# EAGLE design mb_01-2 (EAGLE 7.7.0)
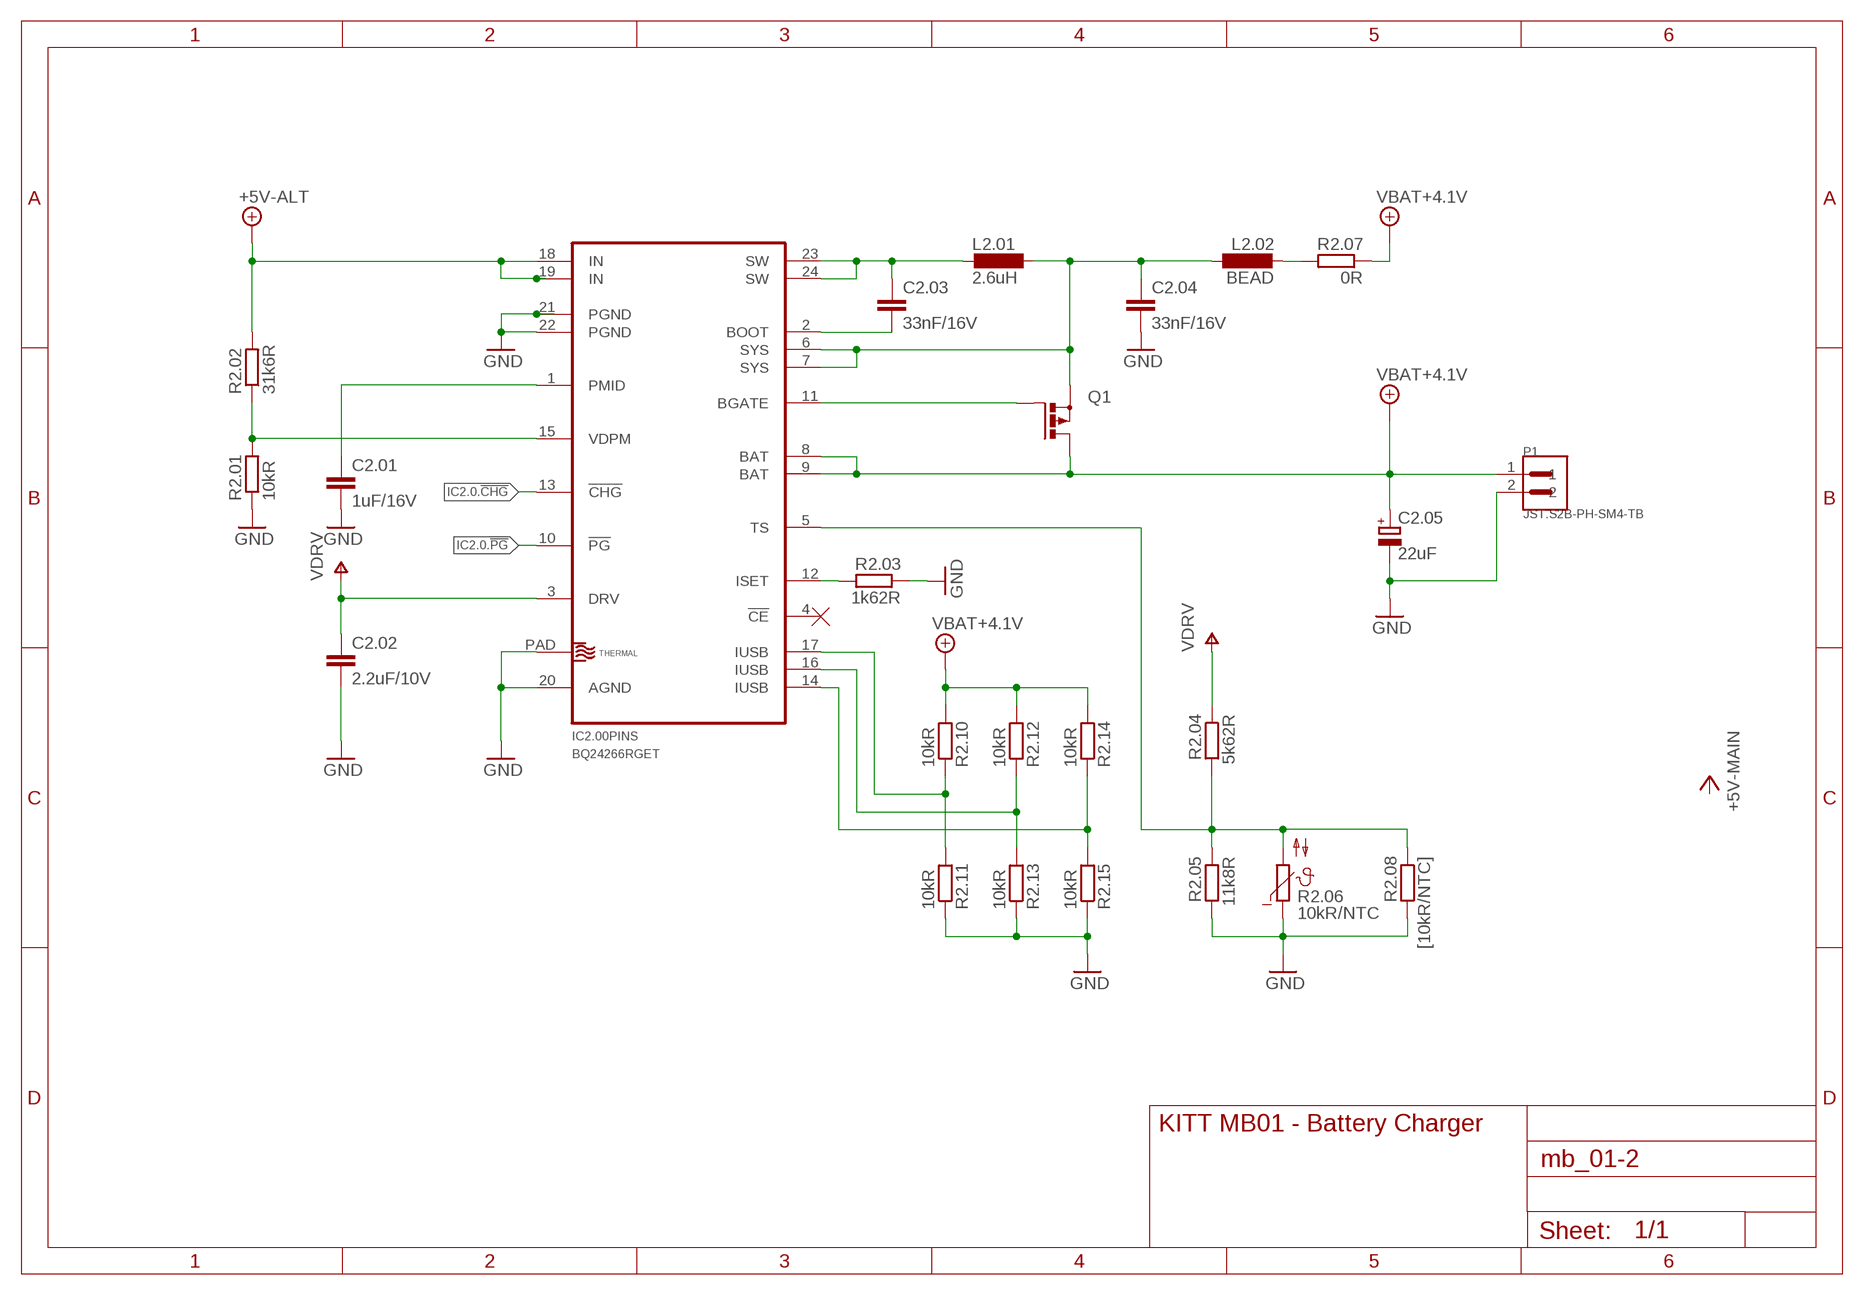
[diagram p0: schematic, sheet 1]

## Parts
C2.01  1uF/16V  C-EUC0805  [C0805]
C2.02  2.2uF/10V  C-EUC0603K  [C0603K]
C2.03  33nF/16V  C-EUC0603  [C0603]
C2.04  33nF/16V  C-EUC0805  [C0805]
C2.05  22uF  CPOL-EUA/3216-18R  [A/3216-18R]
IC2.00  BQ24266RGET  [VQFN-24]
L2.01  2.6uH  L-EUWE-TPC  [POWER-CHOKE_WE-TPC]
L2.02  BEAD  L-EUL2012C  [L2012C]
P1  JST.S2B-PH-SM4-TB  [JST_S2B-PH-SM4-TB(LF)(SN)]
Q1  P-MOSFET-SO8  [SO-08]
R2.01  10kR  R-EU_R0402  [R0402]
R2.02  31k6R  R-EU_R0402  [R0402]
R2.03  1k62R  R-EU_R0402  [R0402]
R2.04  5k62R  R-EU_R0402  [R0402]
R2.05  11k8R  R-EU_R0402  [R0402]
R2.06  10kR/NTC  V642  [P642]
R2.07  0R  R-EU_R0402  [R0402]
R2.08  [10kR/NTC]  R-EU_R0402  [R0402]
R2.10  10kR  R-EU_R0402  [R0402]
R2.11  10kR  R-EU_R0402  [R0402]
R2.12  10kR  R-EU_R0402  [R0402]
R2.13  10kR  R-EU_R0402  [R0402]
R2.14  10kR  R-EU_R0402  [R0402]
R2.15  10kR  R-EU_R0402  [R0402]

## Nets
+4.1V: C2.05.+ IC2.00.8(PINS:BAT) IC2.00.9(PINS:BAT) P1.1 Q1.5(D) Q1.6(D) Q1.7(D) Q1.8(D) R2.07.1 R2.10.2 R2.12.2 R2.14.2 ; supply symbol labelled VBAT+4.1V
+5V: IC2.00.18(PINS:IN) IC2.00.19(PINS:IN) R2.02.2 ; supply symbol labelled +5V-ALT
GND: C2.01.2 C2.02.2 C2.04.2 C2.05.- IC2.00.20(PINS:AGND) IC2.00.21(PINS:PGND) IC2.00.22(PINS:PGND) IC2.00.PAD(PAD:THERMAL) P1.2 R2.01.1 R2.03.1 R2.05.2 R2.06.1 R2.08.2 R2.11.1 R2.13.1 R2.15.1
IC2.0.!CHG: IC2.00.13(PINS:!CHG)
IC2.0.!PG: IC2.00.10(PINS:!PG)
N$8: C2.01.1 IC2.00.1(PINS:PMID)
N$11: IC2.00.15(PINS:VDPM) R2.01.2 R2.02.1
N$12: C2.03.1 IC2.00.23(PINS:SW) IC2.00.24(PINS:SW) L2.01.2
N$13: C2.03.2 IC2.00.2(PINS:BOOT)
N$14: IC2.00.11(PINS:BGATE) Q1.4(G)
N$15: IC2.00.5(PINS:TS) R2.04.2 R2.05.1 R2.06.2 R2.08.1
N$16: L2.02.2 R2.07.2
N$18: C2.04.1 IC2.00.6(PINS:SYS) IC2.00.7(PINS:SYS) L2.01.1 L2.02.1 Q1.1(S) Q1.2(S) Q1.3(S)
N$19: IC2.00.12(PINS:ISET) R2.03.2
N$20: IC2.00.17(PINS:IUSB) R2.10.1 R2.11.2
N$21: IC2.00.16(PINS:IUSB) R2.12.1 R2.13.2
N$22: IC2.00.14(PINS:IUSB) R2.14.1 R2.15.2
V+: C2.02.1 IC2.00.3(PINS:DRV) R2.04.1 ; supply symbol labelled VDRV
Unconnected: IC2.00.4(PINS:!CE)

## Notes on the sheet
- KITT MB01 - Battery Charger

## Library data of the parts
C2.01-C2.04 = rcl:C-EU: CAPACITOR, European symbol
C2.05 = rcl:CPOL-EU: POLARIZED CAPACITOR, European symbol
IC2.00 = kitt.ic:BQ24266RGET
L2.01 L2.02 = rcl:L-EU: INDUCTOR, European symbol
P1 = kitt.con:JST.S2B-PH-SM4-TB: CONN HEADER PH SIDE 2POS 2MM SMD; AVAILABILITY: Good; DESCRIPTION: PH Series 2 Position 2 mm Pitch Surface Mount Side Entry Shrouded Header; MF: JST; MP: S2B-PH-SM4-TB(LF)(SN); PACKAGE: FakePackage u; PRICE: 0.32 USD
Q1 = transistor-power:P-MOSFET-SO8: P-Channel MOSFET Example: FDS4435A; P-Channel Logic Level PowerTrench® MOSFET FDS4465; P-Channel 1.8V Specified PowerTrench® MOSFET Source: www.fairchildsemi.com
R2.01-R2.05 R2.07 R2.08 R2.10-R2.15 = rcl:R-EU_: RESISTOR, European symbol
R2.06 = ptc-ntc:V642: VALVO NTC; OC_FARNELL: unknown; OC_NEWARK: unknown

## Board
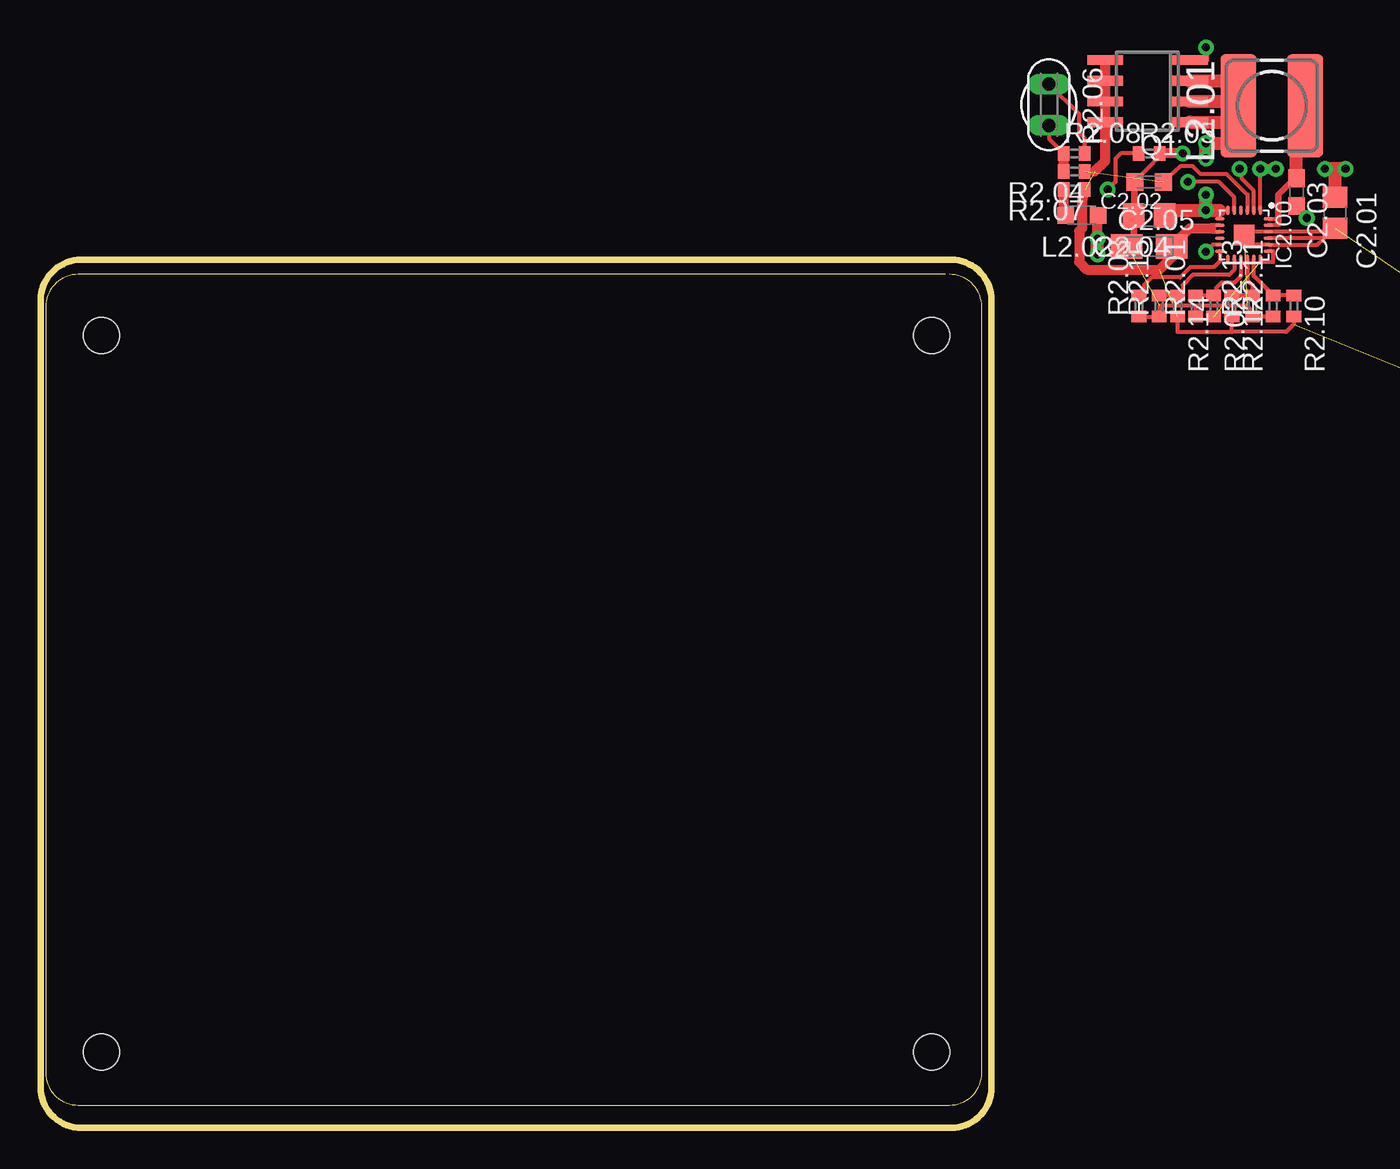
[diagram p1: board, top side]
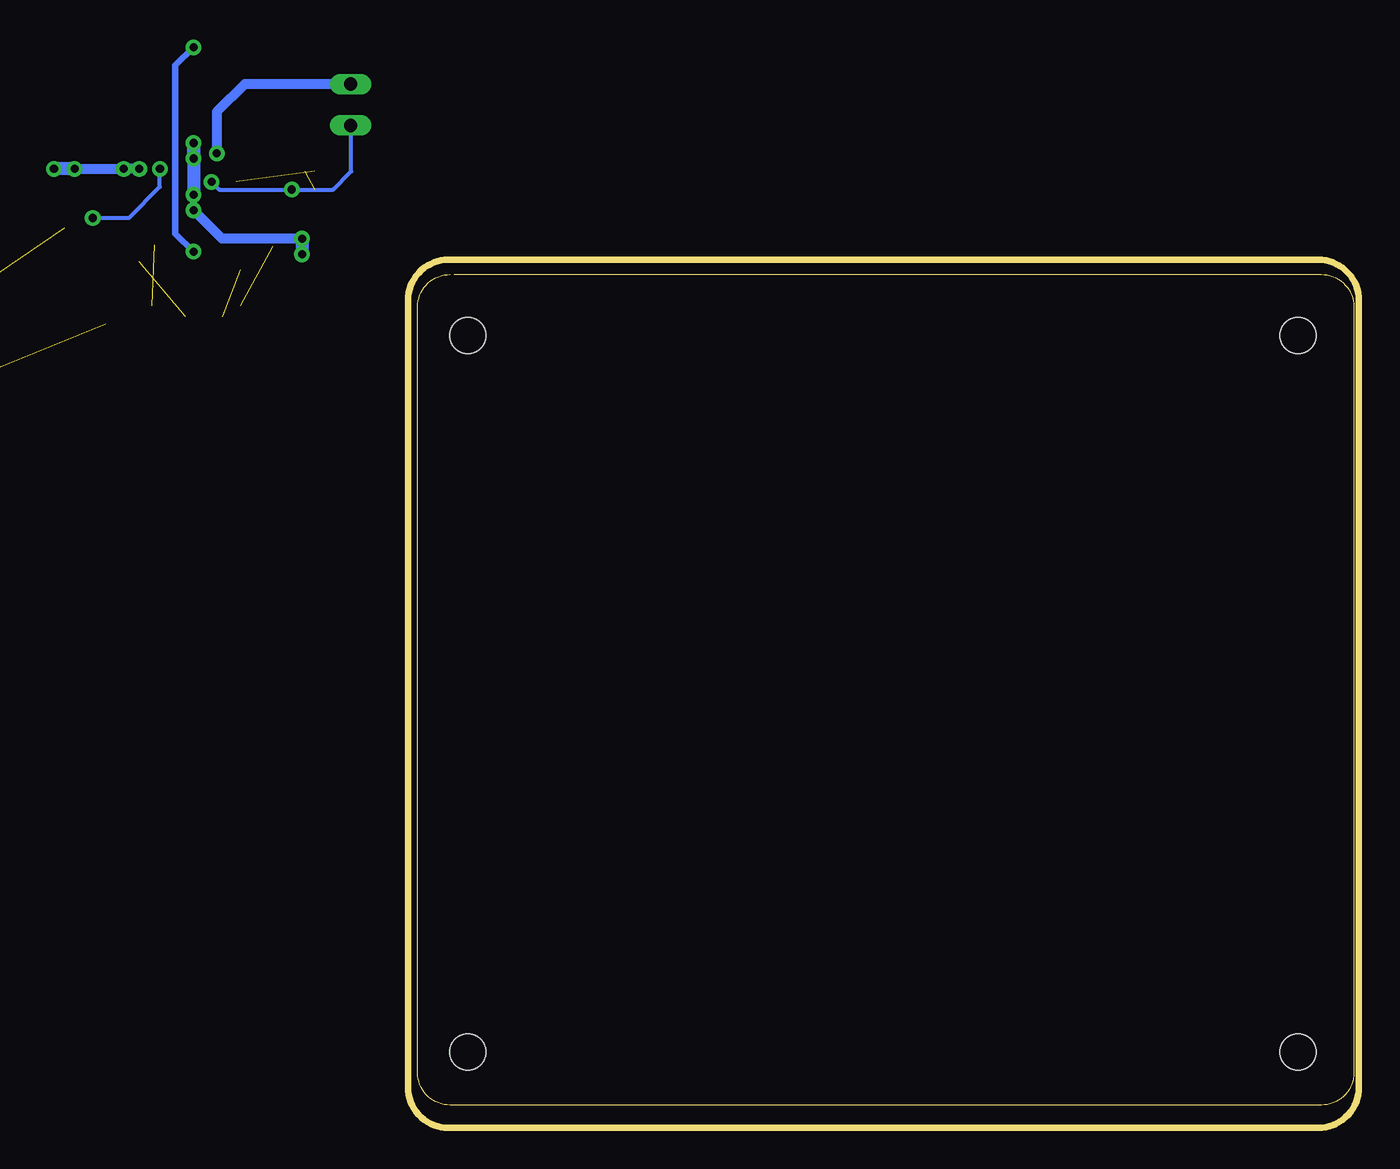
[diagram p2: board, bottom side, seen from below]

Size 58.4 x 53.3 mm. Coordinates in mm from the lower left corner, seen from the top.
Outline: 55.55,52.4 2.3,52.4 arc90 0.3,50.4 0.3,3.4 arc90 2.3,1.4 55.8,1.4 arc90 57.8,3.4 57.8,50.4 arc90 55.8,52.4
Outline: 2.5,53.3 arc90 0,50.8 0,2.5 arc90 2.5,0 55.9,0 arc90 58.4,2.5 58.4,50.8 arc90 55.9,53.3 2.4,53.3
Copper layers (1*2+3*4+5*6+7*16): Top 0.035mm / dielectric 0.2mm / Route2 0.035mm / dielectric 0.15mm / Route3 0.035mm / dielectric 0.2mm / layer 4 0.035mm / dielectric 0.15mm / layer 5 0.035mm / dielectric 0.2mm / layer 6 0.035mm / dielectric 0.15mm / layer 7 0.035mm / dielectric 0.2mm / Bottom 0.035mm
Design rules "default *": minimum track width 6mil, minimum drill 0.25mm, track to track 6mil, track to pad 8mil, pad to pad 8mil, via to via 6mil, smd to smd 8mil, copper to edge 12mil, drill to drill 24mil, minimum pad ring 9mil, minimum via ring 9mil, stop-mask expansion 3mil, vias tented up to drill 0mil, thermal gap 12mil
Holes 2.2 mm at 3.72,4.65 54.72,4.65 3.74,48.64 54.72,48.64
Milling: 4 lines

### Footprints (pad centres in the part's own frame; a part is rotated, then mirrored left to right if it is on the bottom)
C0805 = smd 1.3 x 1.5: 1 -0.95,0; 2 0.95,0
C0603K = smd 1.05 x 1.08: 1 -0.875,0; 2 0.875,0
C0603 = smd 1.1 x 1: 1 -0.85,0; 2 0.85,0
A/3216-18R = smd 1.95 x 1.5: + 1.375,0; - -1.375,0
VQFN-24 = smd 0.6 x 0.23: 1 -1.5,1; 2 -1.5,0.6; 3 -1.5,0.2; 4 -1.5,-0.2; 5 -1.5,-0.6; 6 -1.5,-1; 13 1.5,-1; 14 1.5,-0.6; 15 1.5,-0.2; 16 1.5,0.2; 17 1.5,0.6; 18 1.5,1 | smd 0.23 x 0.6: 7 -1,-1.5; 8 -0.6,-1.5; 9 -0.2,-1.5; 10 0.2,-1.5; 11 0.6,-1.5; 12 1,-1.5; 19 1,1.5; 20 0.6,1.5; 21 0.2,1.5; 22 -0.2,1.5; 23 -0.6,1.5; 24 -1,1.5 | smd 1.27 x 1.27: PAD 0,0
POWER-CHOKE_WE-TPC = smd 6.3 x 2.2: 1 0,2.05; 2 0,-2.05
L2012C = smd 1 x 1: 1 -1,0; 2 1,0
JST_S2B-PH-SM4-TB(LF)(SN) = smd 1 x 3.5: 1 1,0; 2 -1,0 | smd 1.5 x 3.4: P1 3.35,5.75; P2 -3.35,5.75
SO-08 = smd 0.6 x 2.2: 1 -1.905,-2.6; 2 -0.635,-2.6; 3 0.635,-2.6; 4 1.905,-2.6; 5 1.905,2.6; 6 0.635,2.6; 7 -0.635,2.6; 8 -1.905,2.6
R0402 = smd 0.7 x 0.9: 1 -0.65,0; 2 0.65,0
P642 = drill 0.813 long: 1 -1.27,0; 2 1.27,0

### Placement (x,y rotation side)
C2.01  79.5,56.18 270 top  (outside the outline)
C2.02  68.07,58.09 180 top  (outside the outline)
C2.03  77.12,57.45 270 top  (outside the outline)
C2.04  68.07,56.02 180 top  (outside the outline)
C2.05  68.07,54.12 0 top  (outside the outline)
IC2.00  73.9,54.83 270 top  (outside the outline)
L2.01  75.61,62.76 90 top  (outside the outline)
L2.02  63.94,56.02 180 top  (outside the outline)
P1  100.83,40.04 180 top  (outside the outline)
Q1  67.97,63.65 90 top  (outside the outline)
R2.01  70.93,50.46 90 top  (outside the outline)
R2.02  72.04,50.46 270 top  (outside the outline)
R2.03  67.44,50.46 90 top  (outside the outline)
R2.04  63.47,58.72 180 top  (outside the outline)
R2.05  68.07,59.83 0 top  (outside the outline)
R2.06  61.92,62.82 270 top  (outside the outline)
R2.07  63.47,57.61 180 top  (outside the outline)
R2.08  63.47,59.83 0 top  (outside the outline)
R2.10  76.96,50.46 270 top  (outside the outline)
R2.11  75.69,50.46 90 top  (outside the outline)
R2.12  73.15,50.46 270 top  (outside the outline)
R2.13  74.42,50.46 90 top  (outside the outline)
R2.14  69.82,50.46 270 top  (outside the outline)
R2.15  68.68,50.46 90 top  (outside the outline)

### Tracks (layer width: path | path; a pad name or v marks a point on that pad's centre or on a via)
+4.1V  (3 unrouted)
  Top 0.254: IC2.00.9 71.92,55.03 71.88,55.23 71.88,55.43 IC2.00.8 | R2.14.2 69.82,48.88 73.15,48.88 | 73.15,48.88 R2.12.2 | R2.10.2 76.96,49.35 76.48,48.88 73.15,48.88
  Top 0.61: 64.74,58.72 65.37,59.35 Q1.8 Q1.7 Q1.6 Q1.5 | 71.88,55.23 70.56,55.23 C2.05.+ 69.5,54.06 69.5,53.48 68.71,52.69 64.26,52.69 63.78,53.16 63.78,55.07 63.94,55.23 63.94,56.96 R2.07.1
+5V  (1 unrouted)
  Top 0.254: IC2.00.18 74.9,53.16 75.69,53.16 75.69,53.83 IC2.00.19
GND  (via drill 0.5)  (3 unrouted)
  Top 0.254: R2.11.1 R2.13.1 74.42,50.15 74.1,50.46 70.93,50.46 | IC2.00.PAD 74.1,55.03 IC2.00.22 79.2,55.03 C2.01.2 | 73.94,54.75 73.94,54.23 IC2.00.20 78.4,54.23 C2.01.2 | C2.01.2 78.8,54.63 IC2.00.21 | R2.05.2 68.72,59.68 C2.02.2 | R2.08.2 64.12,60.77 63.78,61.1 63.78,62.22 R2.06.1 | R2.03.1 R2.15.1 68.68,49.96 68.71,50.46 70.93,50.46 | R2.01.1 70.93,50.46
  Top 0.406: C2.02.2 C2.04.2 67.12,54.54 C2.05.-
  Top 0.61: v70.13,59.83 R2.05.2
  Bottom 0.61: R2.06.1 68.42,64.09 70.13,62.37 v70.13,59.83
N$8  (via drill 0.5)
  Top 0.254: IC2.00.1 v74.9,58.87 v74.9,58.88
  Top 0.61: v74.9,58.88 v75.85,58.88
  Top 0.813: v78.87,58.88 v80.14,58.88 79.5,58.88 C2.01.1
  Bottom 0.61: v78.87,58.88 v75.85,58.88 v74.9,58.88
  Bottom 0.813: v78.87,58.88 v80.14,58.88
N$11
  Top 0.254: IC2.00.15 73.7,52.29 73.31,51.89 72.52,51.89 72.2,51.58 72.2,51.27 R2.02.1 R2.01.2
N$12
  Top 0.254: IC2.00.23 76.05,55.43 76.01,55.54 76.04,55.83 IC2.00.24
  Top 0.406: C2.03.1 76.86,58.14 76.01,57.29 76.01,55.54
  Top 0.813: C2.03.1 77.12,62.22 L2.01.2
N$13  (via drill 0.5)
  Top 0.254: C2.03.2 77.12,56.5 v77.75,55.86 | IC2.00.2 74.5,57.54 73.76,58.27 73.76,58.74 v73.63,58.88
  Bottom 0.254: v73.63,58.88 73.63,57.77 75.53,55.86 v77.75,55.86
N$14  (via drill 0.5)
  Top 0.254: IC2.00.11 71.99,54.23 v71.56,53.8
  Top 0.406: Q1.4 70.58,65.55 71.56,65.55 v71.56,66.34
  Bottom 0.406: v71.56,53.8 72.67,54.91 72.67,65.23 v71.56,66.34
N$15  (via drill 0.5)
  Top 0.254: IC2.00.5 73.3,57.14 72.36,58.09 v70.45,58.09 | R2.05.1 66.33,59.83 66.01,59.51 66.01,58.09 v65.53,57.61 | R2.06.2 61.92,60.73 R2.08.1
  Top 0.61: R2.08.1 R2.04.2
  Bottom 0.254: v70.45,58.09 69.98,57.61 v65.53,57.61 62.99,57.61 61.88,58.72 61.88,61.51 R2.06.2
N$16
  Top 0.61: R2.07.2 62.82,56.15 L2.02.2
N$18  (via drill 0.5)
  Top 0.254: IC2.00.6 72.4,56.33 IC2.00.7 | 71.56,56.33 v71.56,56.34
  Top 0.61: v64.9,54.59 64.9,55.97 L2.02.1
  Top 0.813: Q1.1 73.56,61.75 | 73.56,61.75 L2.01.1 | Q1.3 73.56,64.29 L2.01.1 | Q1.2 73.56,63.02 L2.01.1 | C2.04.1 69.43,56.33 71.56,56.33 | 71.56,56.33 72.4,56.33 | 73.56,61.75 73.56,60.47 v71.56,60.47 v71.56,59.51 | 71.56,56.33 v71.56,57.29 | v64.9,53.64 v64.9,54.59
  Bottom 0.61: v64.9,54.59 69.82,54.59 v71.56,56.34
  Bottom 0.813: v71.56,59.51 v71.56,60.47 v71.56,57.29 | v64.9,54.59 v64.9,53.64
N$19
  Top 0.254: IC2.00.12 72.4,53.21 72.04,52.85 70.61,52.85 69.98,52.21 68.23,52.21 67.75,51.73 67.75,51.43 R2.03.2
N$20
  Top 0.254: IC2.00.17 74.5,52.3 R2.11.2 R2.10.1
N$21
  Top 0.254: R2.12.1 R2.13.2 74.42,51.73 74.1,52.05 IC2.00.16
N$22
  Top 0.254: IC2.00.14 73.3,52.68 72.99,52.37 70.77,52.37 70.13,51.73 70.13,51.43 R2.14.1 R2.15.2
V+  (1 unrouted)
  Top 0.254: IC2.00.3 74.1,57.29 72.83,58.56 71.25,58.56 70.77,59.04 69.97,59.04 C2.02.1

### Text on the board
Milling: EAGLE EDU LIMIT
Reference: Motor Leads --> | <-- Rail Power Leads